# EAGLE design streams_v02_bargraph (EAGLE 9.7.0)
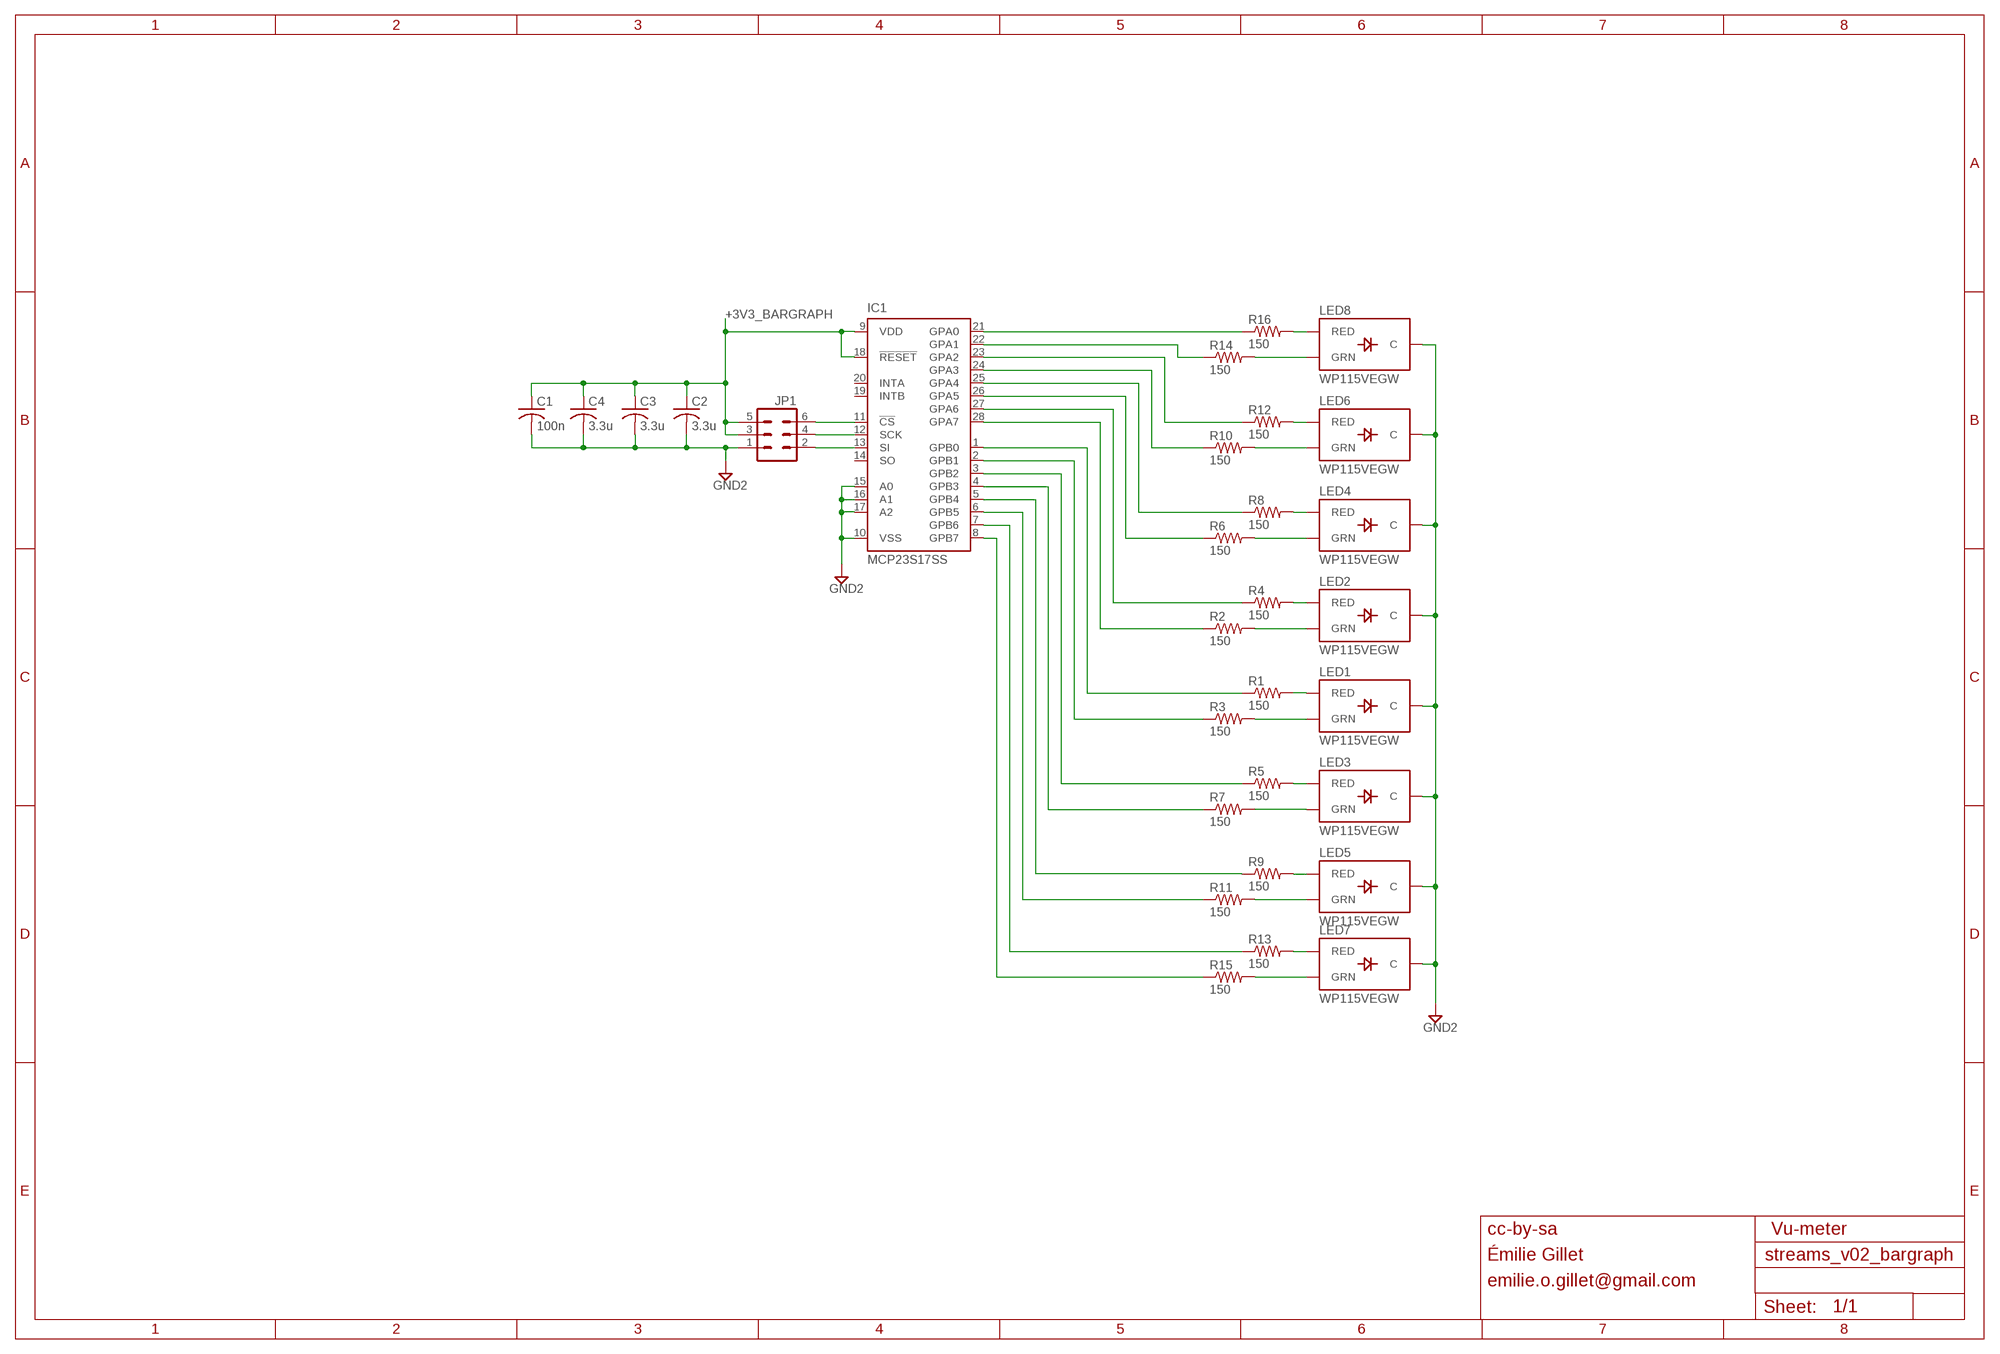
[diagram p0: schematic, sheet 1]

## Parts
C1  100n  C-USC0603  [C0603]
C2  3.3u  C-USC0603  [C0603]
C3  3.3u  C-USC0603  [C0603]
C4  3.3u  C-USC0603  [C0603]
IC1  MCP23S17SS  [SSOP28]
JP1  M03X2  [2X3]
LED1  WP115VEGW  LED-BICOLOR-THROUGHHOLE  [LED-BICOLOR-THROUGHHOLE]
LED2  WP115VEGW  LED-BICOLOR-THROUGHHOLE  [LED-BICOLOR-THROUGHHOLE]
LED3  WP115VEGW  LED-BICOLOR-THROUGHHOLE  [LED-BICOLOR-THROUGHHOLE]
LED4  WP115VEGW  LED-BICOLOR-THROUGHHOLE  [LED-BICOLOR-THROUGHHOLE]
LED5  WP115VEGW  LED-BICOLOR-THROUGHHOLE  [LED-BICOLOR-THROUGHHOLE]
LED6  WP115VEGW  LED-BICOLOR-THROUGHHOLE  [LED-BICOLOR-THROUGHHOLE]
LED7  WP115VEGW  LED-BICOLOR-THROUGHHOLE  [LED-BICOLOR-THROUGHHOLE]
LED8  WP115VEGW  LED-BICOLOR-THROUGHHOLE  [LED-BICOLOR-THROUGHHOLE]
R1  150  R-US_R0603  [R0603]
R2  150  R-US_R0603  [R0603]
R3  150  R-US_R0603  [R0603]
R4  150  R-US_R0603  [R0603]
R5  150  R-US_R0603  [R0603]
R6  150  R-US_R0603  [R0603]
R7  150  R-US_R0603  [R0603]
R8  150  R-US_R0603  [R0603]
R9  150  R-US_R0603  [R0603]
R10  150  R-US_R0603  [R0603]
R11  150  R-US_R0603  [R0603]
R12  150  R-US_R0603  [R0603]
R13  150  R-US_R0603  [R0603]
R14  150  R-US_R0603  [R0603]
R15  150  R-US_R0603  [R0603]
R16  150  R-US_R0603  [R0603]

## Nets
+3V3_BARGRAPH: C1.1 C2.1 C3.1 C4.1 IC1.9(VDD) IC1.18(!RESET) JP1.3 JP1.5
GND2: C1.2 C2.2 C3.2 C4.2 IC1.10(VSS) IC1.15(A0) IC1.16(A1) IC1.17(A2) JP1.1 LED1.2(C) LED2.2(C) LED3.2(C) LED4.2(C) LED5.2(C) LED6.2(C) LED7.2(C) LED8.2(C)
N$1: IC1.11(!CS) JP1.6
N$2: IC1.12(SCK) JP1.4
N$3: LED1.3(RED) R1.2
N$4: IC1.13(SI) JP1.2
N$12: LED1.1(GRN) R3.2
N$21: LED3.3(RED) R5.2
N$22: LED3.1(GRN) R7.2
N$30: LED5.3(RED) R9.2
N$31: LED5.1(GRN) R11.2
N$32: LED7.3(RED) R13.2
N$33: LED7.1(GRN) R15.2
N$34: LED8.3(RED) R16.2
N$35: LED8.1(GRN) R14.2
N$36: LED6.3(RED) R12.2
N$37: LED6.1(GRN) R10.2
N$38: LED4.3(RED) R8.2
N$39: LED4.1(GRN) R6.2
N$40: LED2.3(RED) R4.2
N$41: LED2.1(GRN) R2.2
N$42: IC1.27(GPA6) R4.1
N$44: IC1.28(GPA7) R2.1
N$48: IC1.1(GPB0) R1.1
N$49: IC1.2(GPB1) R3.1
N$50: IC1.21(GPA0) R16.1
N$52: IC1.22(GPA1) R14.1
N$53: IC1.23(GPA2) R12.1
N$54: IC1.24(GPA3) R10.1
N$55: IC1.25(GPA4) R8.1
N$57: IC1.26(GPA5) R6.1
N$58: IC1.3(GPB2) R5.1
N$59: IC1.4(GPB3) R7.1
N$60: IC1.5(GPB4) R9.1
N$61: IC1.6(GPB5) R11.1
N$62: IC1.7(GPB6) R13.1
N$63: IC1.8(GPB7) R15.1
Unconnected: IC1.14(SO) IC1.19(INTB) IC1.20(INTA)

## Notes on the sheet
- cc-by-sa | Vu-meter
- Émilie Gillet
- emilie.o.gillet@gmail.com

## Library data of the parts
C1-C4 = rcl:C-US: CAPACITOR, American symbol
IC1 = microchip:MCP23S17: http://ww1.microchip.com/downloads/en/DeviceDoc/21952a.pdf Source: http://ww1.microchip.com/downloads/en/DeviceDoc/21952a.pdf
JP1 = og-header:M03X2: PIN HEADER
LED1-LED8 = og-leds:LED-BICOLOR-THROUGHHOLE
R1-R16 = rcl:R-US_: RESISTOR, American symbol

## Board
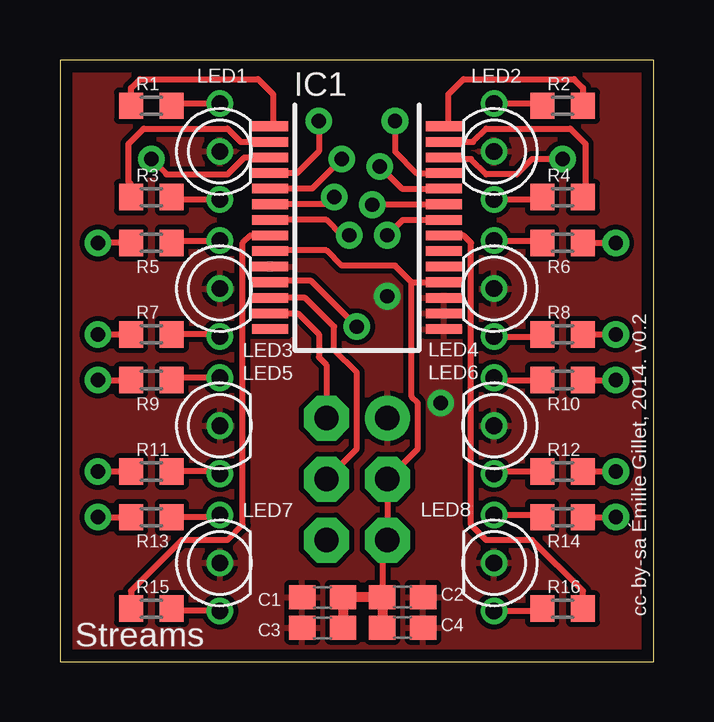
[diagram p1: board, top side]
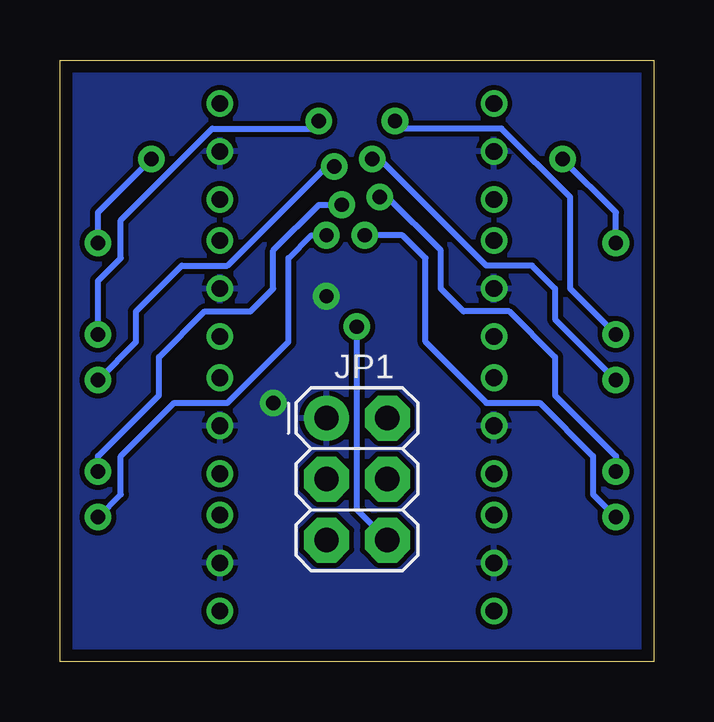
[diagram p2: board, bottom side, seen from below]

Size 24.77 x 25.08 mm. Coordinates in mm from the lower left corner, seen from the top.
Outline: 0,25.08 0,0 24.77,0 24.77,25.08 0,25.08
Copper layers (1*16): Top 0.035mm / dielectric 1.5mm / Bottom 0.035mm
Design rules "PCBCart-Standard": minimum track width 8mil, minimum drill 0.4mm, track to track 8mil, track to pad 8mil, pad to pad 8mil, via to via 8mil, smd to smd 8mil, copper to edge 20mil, drill to drill 8mil, minimum pad ring 8mil, minimum via ring 10mil, stop-mask expansion 3mil, vias tented up to drill 25mil, thermal gap 8mil

### Footprints (pad centres in the part's own frame; a part is rotated, then mirrored left to right if it is on the bottom)
C0603 = smd 1.1 x 1: 1 -0.85,0; 2 0.85,0
SSOP28 = smd 0.4 x 1.5: 1 -4.225,-3.625; 2 -3.575,-3.625; 3 -2.925,-3.625; 4 -2.275,-3.625; 5 -1.625,-3.625; 6 -0.975,-3.625; 7 -0.325,-3.625; 8 0.325,-3.625; 9 0.975,-3.625; 10 1.625,-3.625; 11 2.275,-3.625; 12 2.925,-3.625; 13 3.575,-3.625; 14 4.225,-3.625; 15 4.225,3.625; 16 3.575,3.625; 17 2.925,3.625; 18 2.275,3.625; 19 1.625,3.625; 20 0.975,3.625; 21 0.325,3.625; 22 -0.325,3.625; 23 -0.975,3.625; 24 -1.625,3.625; 25 -2.275,3.625; 26 -2.925,3.625; 27 -3.575,3.625; 28 -4.225,3.625
2X3 = drill 1.016 pad 1.88: 1 -2.54,-1.27 | drill 1.016 pad 1.88 octagon: 2 -2.54,1.27; 3 0,-1.27; 4 0,1.27; 5 2.54,-1.27; 6 2.54,1.27
LED-BICOLOR-THROUGHHOLE = drill 0.7: 1 -2,0; 2 0,0; 3 2,0
R0603 = smd 1 x 1.1: 1 -0.85,0; 2 0.85,0

### Placement (x,y rotation side)
C1  10.95,2.7 180 top
C2  14.29,2.7 0 top
C3  10.95,1.43 180 top
C4  14.29,1.43 0 top
IC1  12.38,18.1 270 top
JP1  12.38,7.62 270 bottom
LED1  6.67,21.27 90 top
LED2  18.1,21.27 270 top
LED3  6.67,15.56 90 top
LED4  18.1,15.56 270 top
LED5  6.67,9.84 90 top
LED6  18.1,9.84 270 top
LED7  6.67,4.13 90 top
LED8  18.1,4.13 270 top
R1  3.81,23.18 0 top
R2  20.95,23.18 180 top
R3  3.81,19.37 0 top
R4  20.95,19.37 180 top
R5  3.81,17.46 0 top
R6  20.95,17.46 180 top
R7  3.81,13.65 0 top
R8  20.95,13.65 180 top
R9  3.81,11.75 0 top
R10  20.95,11.75 180 top
R11  3.81,7.94 0 top
R12  20.95,7.94 180 top
R13  3.81,6.03 0 top
R14  20.95,6.03 180 top
R15  3.81,2.22 0 top
R16  20.95,2.22 180 top

### Tracks (layer width: path | path; a pad name or v marks a point on that pad's centre or on a via)
+3V3_BARGRAPH
  Top 0.254: IC1.9 8.78,17.14 11.11,17.14 11.75,16.51 13.97,16.51 14.66,15.82 | 14.66,15.82 IC1.18 | 14.66,15.82 14.66,11.06 14.92,10.79 14.92,8.89 JP1.3 JP1.5 13.44,4.87 C2.1
  Top 0.406: C3.1 C1.1 C2.1 | C2.1 | C2.1 C4.1
GND2  (via drill 0.6)
  other vias: 13.65,15.24 15.88,10.79
  pour Bottom: 24.77,25.08 24.77,0 0,0 0,25.08
  pour Top: 0,25.08 0,0 24.77,0 24.77,25.08
N$1  (via drill 0.6)
  Top 0.254: IC1.11 8.81,15.88 10.48,15.88 v12.38,13.97
  Bottom 0.254: v12.38,13.97 12.38,6.35 JP1.6
N$2
  Top 0.254: JP1.4 12.38,8.89 12.38,12.07 11.43,13.02 11.43,13.97 10.23,15.17 IC1.12
N$3
  Top 0.254: R1.2 4.75,23.27 LED1.3
N$4
  Top 0.254: JP1.2 11.11,12.38 10.8,12.7 10.8,13.65 9.92,14.52 IC1.13
N$12
  Top 0.254: R3.2 4.75,19.27 LED1.1
N$21
  Top 0.254: R5.2 4.75,17.56 LED3.3
N$22
  Top 0.254: LED3.1 6.57,13.65 R7.2
N$30
  Top 0.254: R9.2 4.75,11.84 LED5.3
N$31
  Top 0.254: LED5.1 6.57,7.94 R11.2
N$32
  Top 0.254: LED7.3 6.57,6.03 R13.2
N$33
  Top 0.254: R15.2 4.75,2.13 LED7.1
N$34
  Top 0.254: R16.2 20.01,2.13 LED8.3
N$35
  Top 0.254: R14.2 20.01,6.13 LED8.1
N$36
  Top 0.254: LED6.3 18.19,7.94 R12.2
N$37
  Top 0.254: LED6.1 18.19,11.75 R10.2
N$38
  Top 0.254: R8.2 20.01,13.56 LED4.3
N$39
  Top 0.254: R6.2 20.01,17.56 LED4.1
N$40
  Top 0.254: R4.2 20.01,19.27 LED2.3
N$41
  Top 0.254: R2.2 20.01,23.27 LED2.1
N$42
  Top 0.254: R4.1 21.91,19.47 21.91,21.59 21.27,22.23 17.78,22.23 17.23,21.67 IC1.27
N$44
  Top 0.254: IC1.28 16.19,22.51 16.19,23.65 16.83,24.29 21.43,24.29 21.8,23.92 R2.1
N$48
  Top 0.254: IC1.1 8.89,22.46 8.89,23.65 8.25,24.29 3.33,24.29 2.96,23.92 R1.1
N$49
  Top 0.254: IC1.2 7.54,21.67 6.99,22.23 3.49,22.23 2.86,21.59 2.86,20 2.96,19.9 R3.1
N$50
  Top 0.254: IC1.21 16.01,17.78 16.83,17.78 17.15,17.46 17.15,5.71 17.78,5.08 19.69,5.08 21.8,2.96 R16.1
N$52  (via drill 0.6)
  Top 0.254: R14.1 v23.18,6.03 | v13.65,17.78 14.3,18.42 IC1.22
  Bottom 0.254: v23.18,6.03 22.22,6.99 22.22,8.57 20,10.79 17.78,10.79 15.24,13.34 15.24,16.83 14.29,17.78 v13.65,17.78
N$53  (via drill 0.6)
  Top 0.254: R12.1 v23.18,7.94 | v13.02,19.05 13.04,19.07 IC1.23
  Bottom 0.254: v13.02,19.05 13.97,19.05 15.88,17.14 15.88,15.56 16.83,14.61 18.73,14.61 20.64,12.7 20.64,11.11 23.18,8.57 v23.18,7.94
N$54  (via drill 0.6)
  Top 0.254: R10.1 v23.18,11.75 | v13.34,20.64 14.25,19.72 IC1.24
  Bottom 0.254: v13.34,20.64 13.65,20.64 17.78,16.51 19.69,16.51 21.59,14.61 21.59,13.34 v23.18,11.75
N$55  (via drill 0.6)
  Top 0.254: v13.97,22.54 13.97,21.27 14.87,20.37 IC1.25 | R8.1 v23.18,13.65
  Bottom 0.254: v23.18,13.65 23.18,15.88 22.22,16.83 22.22,18.41 18.41,22.23 14.29,22.23 v13.97,22.54
N$57  (via drill 0.6)
  Top 0.254: IC1.26 16.07,20.96 17.15,20.96 17.78,20.32 19.05,20.32 19.69,20.96 v20.95,20.96 | R6.1 v23.18,17.46
  Bottom 0.254: v20.95,20.96 23.18,18.73 v23.18,17.46
N$58  (via drill 0.6)
  Top 0.254: R5.1 v1.59,17.46 | v3.81,20.96 4.44,20.32 6.99,20.32 7.69,21.02 IC1.3
  Bottom 0.254: v1.59,17.46 1.59,18.73 v3.81,20.96
N$59  (via drill 0.6)
  Top 0.254: v1.59,13.65 R7.1 | v10.8,22.54 10.8,21.27 9.9,20.37 IC1.4
  Bottom 0.254: v1.59,13.65 3.49,15.56 3.49,19.37 6.35,22.23 10.48,22.23 v10.8,22.54
N$60  (via drill 0.6)
  Top 0.254: v1.59,11.75 R9.1 | v11.75,20.96 10.52,19.72 IC1.5
  Bottom 0.254: v1.59,11.75 4.13,14.29 4.13,15.56 5.08,16.51 6.99,16.51 11.43,20.96 v11.75,20.96
N$61  (via drill 0.6)
  Top 0.254: v1.59,7.94 R11.1 | v11.43,19.37 11.13,19.07 IC1.6
  Bottom 0.254: v1.59,7.94 1.59,8.57 4.13,11.11 4.13,12.7 6.03,14.61 7.94,14.61 8.89,15.56 8.89,17.14 11.11,19.37 v11.43,19.37
N$62  (via drill 0.6)
  Top 0.254: v1.59,6.03 R13.1 | v12.06,17.78 11.75,17.78 11.1,18.42 IC1.7
  Bottom 0.254: v1.59,6.03 2.54,6.99 2.54,8.57 4.76,10.79 6.99,10.79 9.53,13.34 9.53,16.83 10.48,17.78 v12.06,17.78
N$63
  Top 0.254: IC1.8 8.75,17.78 7.94,17.78 7.62,17.46 7.62,5.71 6.99,5.08 5.08,5.08 2.96,2.96 R15.1

### Text on the board
tNames: cc-by-sa Émilie Gillet, 2014. v0.2 | Streams